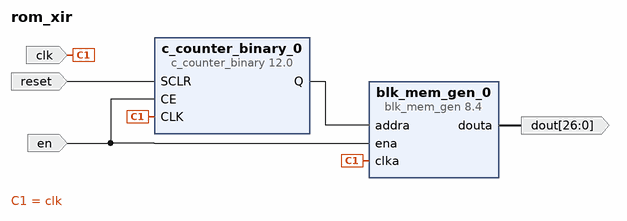
[diagram p0: block diagram of the top level]
# Vivado block design rom_xir, xc7a35tcpg236-1, Vivado 2018.3
create_bd_design rom_xir

create_bd_port -dir I en
create_bd_port -dir I clk
create_bd_port -dir I reset
create_bd_port -dir O -from 26 -to 0 -type data dout

create_bd_cell -type ip -vlnv xilinx.com:ip:blk_mem_gen:8.4 blk_mem_gen_0
set_property -dict [list \
  CONFIG.Coe_File ../../../../../../prova1.sim/sim_1/behav/xsim/rom_xir.coe \
  CONFIG.Enable_32bit_Address false \
  CONFIG.Load_Init_File true \
  CONFIG.Memory_Type Single_Port_ROM \
  CONFIG.Port_A_Write_Rate 0 \
  CONFIG.Register_PortA_Output_of_Memory_Primitives true \
  CONFIG.Use_RSTA_Pin false \
  CONFIG.Write_Depth_A 100 \
  CONFIG.Write_Width_A 27 \
  CONFIG.use_bram_block Stand_Alone \
] [get_bd_cells blk_mem_gen_0]
create_bd_cell -type ip -vlnv xilinx.com:ip:c_counter_binary:12.0 c_counter_binary_0
set_property -dict {CONFIG.CE true CONFIG.Output_Width 7 CONFIG.SCLR true CONFIG.SSET false} [get_bd_cells c_counter_binary_0]

# ---- connections ----

connect_bd_net [get_bd_pins c_counter_binary_0/Q] [get_bd_pins blk_mem_gen_0/addra]
connect_bd_net [get_bd_ports clk] [get_bd_pins c_counter_binary_0/CLK] [get_bd_pins blk_mem_gen_0/clka]
connect_bd_net [get_bd_ports en] [get_bd_pins blk_mem_gen_0/ena] [get_bd_pins c_counter_binary_0/CE]
connect_bd_net [get_bd_ports reset] [get_bd_pins c_counter_binary_0/SCLR]
connect_bd_net [get_bd_pins blk_mem_gen_0/douta] [get_bd_ports dout]

validate_bd_design
save_bd_design
